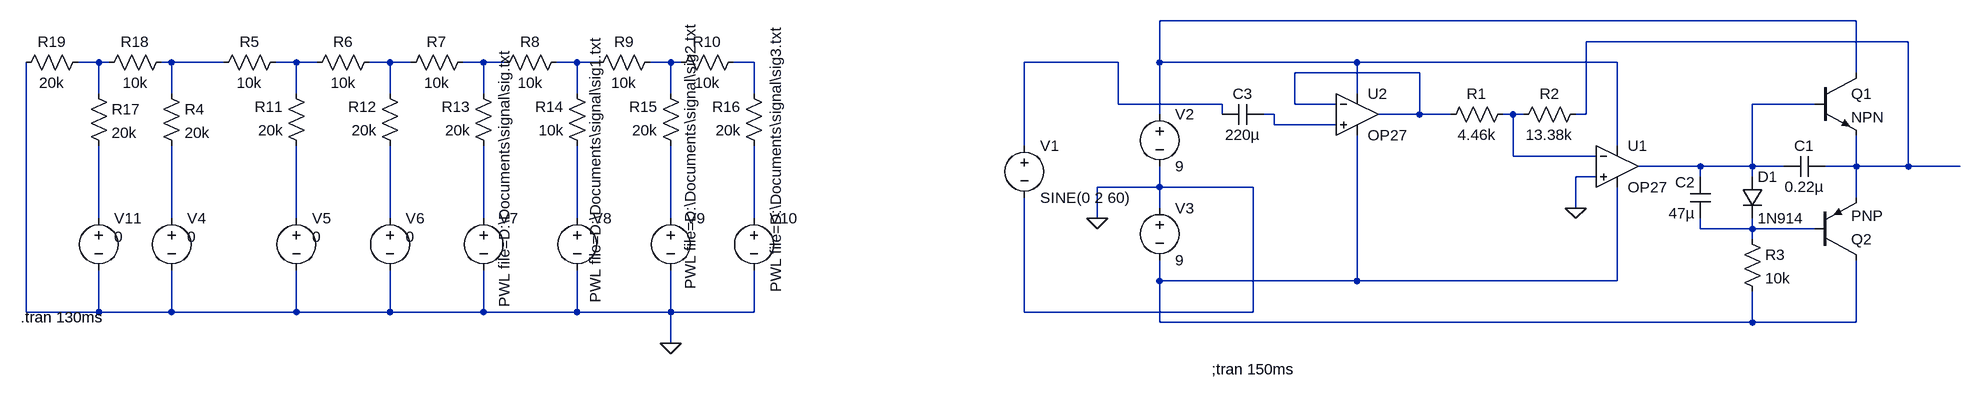
[diagram p0: schematic Kurs.asc]
Kurs.asc, the LTspice schematic file:
Version 4
SHEET 1 1140 680
WIRE 512 -96 -560 -96
WIRE 592 -64 96 -64
WIRE -2192 -32 -2224 -32
WIRE -2176 -32 -2192 -32
WIRE -2080 -32 -2096 -32
WIRE -2000 -32 -2080 -32
WIRE -1888 -32 -1920 -32
WIRE -1856 -32 -1888 -32
WIRE -1744 -32 -1776 -32
WIRE -1712 -32 -1744 -32
WIRE -1600 -32 -1632 -32
WIRE -1568 -32 -1600 -32
WIRE -1456 -32 -1488 -32
WIRE -1424 -32 -1456 -32
WIRE -1312 -32 -1344 -32
WIRE -1296 -32 -1312 -32
WIRE -1184 -32 -1216 -32
WIRE -624 -32 -768 -32
WIRE -560 -32 -560 -96
WIRE -256 -32 -560 -32
WIRE 144 -32 -256 -32
WIRE -160 -16 -352 -16
WIRE 512 -16 512 -96
WIRE -2192 16 -2192 -32
WIRE -2080 16 -2080 -32
WIRE -1888 16 -1888 -32
WIRE -1744 16 -1744 -32
WIRE -1600 16 -1600 -32
WIRE -1456 16 -1456 -32
WIRE -1312 16 -1312 -32
WIRE -1184 16 -1184 -32
WIRE -256 16 -256 -32
WIRE -624 32 -624 -32
WIRE -464 32 -624 32
WIRE -352 32 -352 -16
WIRE -288 32 -352 32
WIRE 448 32 352 32
WIRE -560 48 -560 -32
WIRE -464 48 -464 32
WIRE -384 48 -400 48
WIRE -160 48 -160 -16
WIRE -160 48 -224 48
WIRE -112 48 -160 48
WIRE -16 48 -32 48
WIRE 0 48 -16 48
WIRE 96 48 96 -64
WIRE 96 48 80 48
WIRE -384 64 -384 48
WIRE -288 64 -384 64
WIRE -768 96 -768 -32
WIRE 144 96 144 -32
WIRE -16 112 -16 48
WIRE 112 112 -16 112
WIRE 272 128 176 128
WIRE 352 128 352 32
WIRE 352 128 272 128
WIRE 400 128 352 128
WIRE 512 128 512 80
WIRE 512 128 464 128
WIRE 592 128 592 -64
WIRE 592 128 512 128
WIRE 672 128 592 128
WIRE 112 144 80 144
WIRE 272 144 272 128
WIRE 352 144 352 128
WIRE -560 160 -560 128
WIRE -560 160 -656 160
WIRE -416 160 -560 160
WIRE 512 176 512 128
WIRE -560 192 -560 160
WIRE 80 192 80 144
WIRE -2192 208 -2192 96
WIRE -2080 208 -2080 96
WIRE -1888 208 -1888 96
WIRE -1744 208 -1744 96
WIRE -1600 208 -1600 96
WIRE -1456 208 -1456 96
WIRE -1312 208 -1312 96
WIRE -1184 208 -1184 96
WIRE -656 208 -656 160
WIRE 272 224 272 208
WIRE 352 224 352 208
WIRE 352 224 272 224
WIRE 448 224 352 224
WIRE 352 240 352 224
WIRE -560 304 -560 272
WIRE -256 304 -256 80
WIRE -256 304 -560 304
WIRE 144 304 144 160
WIRE 144 304 -256 304
WIRE -2304 352 -2304 -32
WIRE -2192 352 -2192 288
WIRE -2192 352 -2304 352
WIRE -2080 352 -2080 288
WIRE -2080 352 -2192 352
WIRE -1888 352 -1888 288
WIRE -1888 352 -2080 352
WIRE -1744 352 -1744 288
WIRE -1744 352 -1888 352
WIRE -1600 352 -1600 288
WIRE -1600 352 -1744 352
WIRE -1456 352 -1456 288
WIRE -1456 352 -1600 352
WIRE -1312 352 -1312 288
WIRE -1312 352 -1456 352
WIRE -1184 352 -1184 288
WIRE -1184 352 -1312 352
WIRE -768 352 -768 176
WIRE -416 352 -416 160
WIRE -416 352 -768 352
WIRE -560 368 -560 304
WIRE 352 368 352 320
WIRE 352 368 -560 368
WIRE 512 368 512 272
WIRE 512 368 352 368
WIRE -1312 400 -1312 352
FLAG -656 208 0
FLAG -1312 400 0
FLAG 80 192 0
SYMBOL npn 448 -16 R0
SYMATTR InstName Q1
SYMBOL pnp 448 272 M180
SYMATTR InstName Q2
SYMBOL voltage -560 32 R0
WINDOW 123 0 0 Left 2
WINDOW 39 0 0 Left 2
SYMATTR InstName V2
SYMATTR Value 9
SYMBOL Opamps\\OP27 144 64 R0
SYMATTR InstName U1
SYMBOL voltage -560 176 R0
WINDOW 123 0 0 Left 2
WINDOW 39 0 0 Left 2
SYMATTR InstName V3
SYMATTR Value 9
SYMBOL res -16 32 R90
WINDOW 0 0 56 VBottom 2
WINDOW 3 32 56 VTop 2
SYMATTR InstName R1
SYMATTR Value 4.46k
SYMBOL res 96 32 R90
WINDOW 0 0 56 VBottom 2
WINDOW 3 32 56 VTop 2
SYMATTR InstName R2
SYMATTR Value 13.38k
SYMBOL diode 336 144 R0
SYMATTR InstName D1
SYMATTR Value 1N914
SYMBOL res 336 224 R0
SYMATTR InstName R3
SYMATTR Value 10k
SYMBOL cap 464 112 R90
WINDOW 0 0 32 VBottom 2
WINDOW 3 32 32 VTop 2
SYMATTR InstName C1
SYMATTR Value 0.22µ
SYMBOL cap 288 208 R180
WINDOW 0 24 56 Left 2
WINDOW 3 24 8 Left 2
SYMATTR InstName C2
SYMATTR Value 47µ
SYMBOL res -2096 0 R0
SYMATTR InstName R4
SYMATTR Value 20k
SYMBOL res -1904 -48 R90
WINDOW 0 0 56 VBottom 2
WINDOW 3 32 56 VTop 2
SYMATTR InstName R5
SYMATTR Value 10k
SYMBOL res -1760 -48 R90
WINDOW 0 0 56 VBottom 2
WINDOW 3 32 56 VTop 2
SYMATTR InstName R6
SYMATTR Value 10k
SYMBOL res -1616 -48 R90
WINDOW 0 0 56 VBottom 2
WINDOW 3 32 56 VTop 2
SYMATTR InstName R7
SYMATTR Value 10k
SYMBOL res -1472 -48 R90
WINDOW 0 0 56 VBottom 2
WINDOW 3 32 56 VTop 2
SYMATTR InstName R8
SYMATTR Value 10k
SYMBOL res -1328 -48 R90
WINDOW 0 0 56 VBottom 2
WINDOW 3 32 56 VTop 2
SYMATTR InstName R9
SYMATTR Value 10k
SYMBOL res -1200 -48 R90
WINDOW 0 0 56 VBottom 2
WINDOW 3 32 56 VTop 2
SYMATTR InstName R10
SYMATTR Value 10k
SYMBOL res -1872 112 R180
WINDOW 0 36 76 Left 2
WINDOW 3 36 40 Left 2
SYMATTR InstName R11
SYMATTR Value 20k
SYMBOL res -1728 112 R180
WINDOW 0 36 76 Left 2
WINDOW 3 36 40 Left 2
SYMATTR InstName R12
SYMATTR Value 20k
SYMBOL res -1584 112 R180
WINDOW 0 36 76 Left 2
WINDOW 3 36 40 Left 2
SYMATTR InstName R13
SYMATTR Value 20k
SYMBOL res -1440 112 R180
WINDOW 0 36 76 Left 2
WINDOW 3 36 40 Left 2
SYMATTR InstName R14
SYMATTR Value 10k
SYMBOL res -1296 112 R180
WINDOW 0 36 76 Left 2
WINDOW 3 36 40 Left 2
SYMATTR InstName R15
SYMATTR Value 20k
SYMBOL res -1168 112 R180
WINDOW 0 36 76 Left 2
WINDOW 3 36 40 Left 2
SYMATTR InstName R16
SYMATTR Value 20k
SYMBOL voltage -2080 192 R0
WINDOW 123 0 0 Left 2
WINDOW 39 0 0 Left 2
WINDOW 3 24 44 Left 2
SYMATTR Value 0
SYMATTR InstName V4
SYMBOL voltage -1888 192 R0
WINDOW 123 0 0 Left 2
WINDOW 39 0 0 Left 2
WINDOW 3 24 44 Left 2
SYMATTR Value 0
SYMATTR InstName V5
SYMBOL voltage -1744 192 R0
WINDOW 123 0 0 Left 2
WINDOW 39 0 0 Left 2
WINDOW 3 24 44 Left 2
SYMATTR Value 0
SYMATTR InstName V6
SYMBOL voltage -1600 192 R0
WINDOW 123 0 0 Left 2
WINDOW 39 0 0 Left 2
WINDOW 3 32 153 VLeft 2
SYMATTR Value PWL file=D:\Documents\signal\sig.txt
SYMATTR InstName V7
SYMBOL voltage -1456 192 R0
WINDOW 123 0 0 Left 2
WINDOW 39 0 0 Left 2
WINDOW 3 28 146 VLeft 2
SYMATTR Value PWL file=D:\Documents\signal\sig1.txt
SYMATTR InstName V8
SYMBOL voltage -1312 192 R0
WINDOW 123 0 0 Left 2
WINDOW 39 0 0 Left 2
WINDOW 3 30 -284 VRight 2
SYMATTR Value PWL file=D:\Documents\signal\sig2.txt
SYMATTR InstName V9
SYMBOL voltage -1184 192 R0
WINDOW 123 0 0 Left 2
WINDOW 39 0 0 Left 2
WINDOW 3 34 -280 VRight 2
SYMATTR Value PWL file=D:\Documents\signal\sig3.txt
SYMATTR InstName V10
SYMBOL res -2208 0 R0
SYMATTR InstName R17
SYMATTR Value 20k
SYMBOL res -2080 -48 R90
WINDOW 0 0 56 VBottom 2
WINDOW 3 32 56 VTop 2
SYMATTR InstName R18
SYMATTR Value 10k
SYMBOL res -2208 -48 R90
WINDOW 0 0 56 VBottom 2
WINDOW 3 32 56 VTop 2
SYMATTR InstName R19
SYMATTR Value 20k
SYMBOL voltage -2192 192 R0
WINDOW 123 0 0 Left 2
WINDOW 39 0 0 Left 2
WINDOW 3 24 44 Left 2
SYMATTR Value 0
SYMATTR InstName V11
SYMBOL Opamps\\OP27 -256 -16 R0
SYMATTR InstName U2
SYMBOL cap -400 32 R90
WINDOW 0 0 32 VBottom 2
WINDOW 3 32 32 VTop 2
SYMATTR InstName C3
SYMATTR Value 220µ
SYMBOL voltage -768 80 R0
WINDOW 123 0 0 Left 2
WINDOW 39 0 0 Left 2
SYMATTR InstName V1
SYMATTR Value SINE(0 2 60)
TEXT -480 440 Left 2 !;tran 150ms
TEXT -2312 360 Left 2 !.tran 130ms

The netlist it stands for:
* Kurs.asc
Q1 N001 N013 N002 0 NPN
Q2 N025 N024 N002 0 PNP
V2 N001 0 9
XU1 0 N015 N001 N025 N013 OP27  ; pins In+ In- V+ V- OUT
V3 0 N025 9
R1 N015 N012 4.46k
R2 N002 N015 13.38k
D1 N013 N024 1N914
R3 N024 N025 10k
C1 N002 N013 0.22µ
C2 N024 N013 47µ
R4 N004 N017 20k
R5 N005 N004 10k
R6 N006 N005 10k
R7 N007 N006 10k
R8 N008 N007 10k
R9 N009 N008 10k
R10 N010 N009 10k
R11 N018 N005 20k
R12 N019 N006 20k
R13 N020 N007 20k
R14 N021 N008 10k
R15 N022 N009 20k
R16 N023 N010 20k
V4 N017 0 0
V5 N018 0 0
V6 N019 0 0
V7 N020 0 PWL file=D:\Documents\signal\sig.txt
V8 N021 0 PWL file=D:\Documents\signal\sig1.txt
V9 N022 0 PWL file=D:\Documents\signal\sig2.txt
V10 N023 0 PWL file=D:\Documents\signal\sig3.txt
R17 N003 N016 20k
R18 N004 N003 10k
R19 N003 0 20k
V11 N016 0 0
XU2 N014 N012 N001 N025 N012 OP27  ; pins In+ In- V+ V- OUT
C3 N014 N011 220µ
V1 N011 0 SINE(0 2 60)
.model D D
.lib standard.dio
.model NPN NPN
.model PNP PNP
.lib standard.bjt
;tran 150ms
.tran 130ms
.lib ADI.lib
.backanno
.end